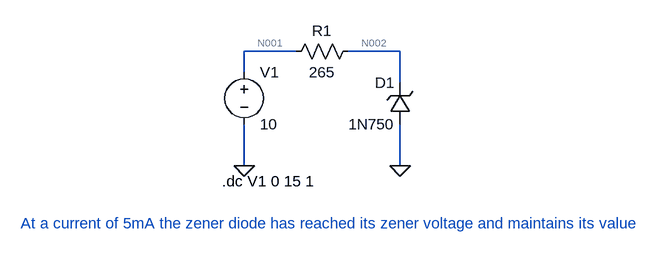
[diagram p0: schematic zener_1-16.asc]
zener_1-16.asc, the LTspice schematic file:
Version 4
SHEET 1 1408 680
WIRE 48 64 -32 64
WIRE 208 64 128 64
WIRE -32 96 -32 64
WIRE 208 112 208 64
WIRE -32 240 -32 176
WIRE 208 240 208 176
FLAG 208 240 0
FLAG -32 240 0
SYMBOL zener 224 176 R180
WINDOW 0 24 64 Left 2
WINDOW 3 24 0 Left 2
SYMATTR InstName D1
SYMATTR Value 1N750
SYMBOL res 144 48 R90
WINDOW 0 0 56 VBottom 2
WINDOW 3 32 56 VTop 2
SYMATTR InstName R1
SYMATTR Value 265
SYMBOL voltage -32 80 R0
WINDOW 123 0 0 Left 0
WINDOW 39 0 0 Left 0
SYMATTR InstName V1
SYMATTR Value 10
TEXT -66 264 Left 2 !.dc V1 0 15 1
TEXT -376 328 Left 2 ;At a current of 5mA the zener diode has reached its zener voltage and maintains its value

The netlist it stands for:
* zener_1-16.asc
D1 0 N002 1N750
R1 N002 N001 265
V1 N001 0 10
.model D D
.lib standard.dio
.dc V1 0 15 1
* At a current of 5mA the zener diode has reached its zener voltage and maintains its value
.backanno
.end

* Results of the author's LTspice run, read from the files saved beside the schematic
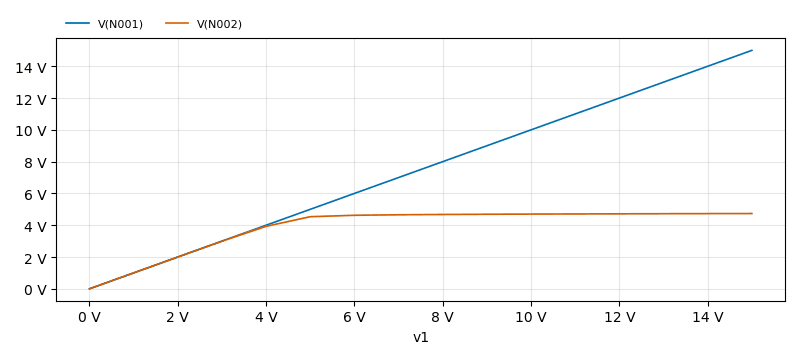
[diagram p1: DC transfer characteristic of zener_1-16.asc, plotted from the saved traces]
* DC transfer characteristic, 1 run:
*   V(N001): 0 V at v1=0 V, 15 V at v1=15 V, min 0 V, max 15 V
*   V(N002): 0 V at v1=0 V, 4.736 V at v1=15 V, min 0 V, max 4.736 V